# EAGLE schematic avr-isp (EAGLE 6.3)
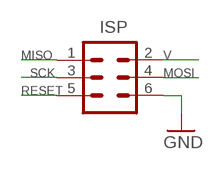
[diagram p0: schematic, sheet 1]

## Parts
ISP  MA03-2  [MA03-2]

## Nets
GND: ISP.6
MISO: ISP.1
MOSI: ISP.4
RESET: ISP.5
SCK: ISP.3
V: ISP.2

## Library data of the parts
ISP = con-lstb:MA03-2: PIN HEADER